# Altium schematic sheet output2.SchDoc
size A4
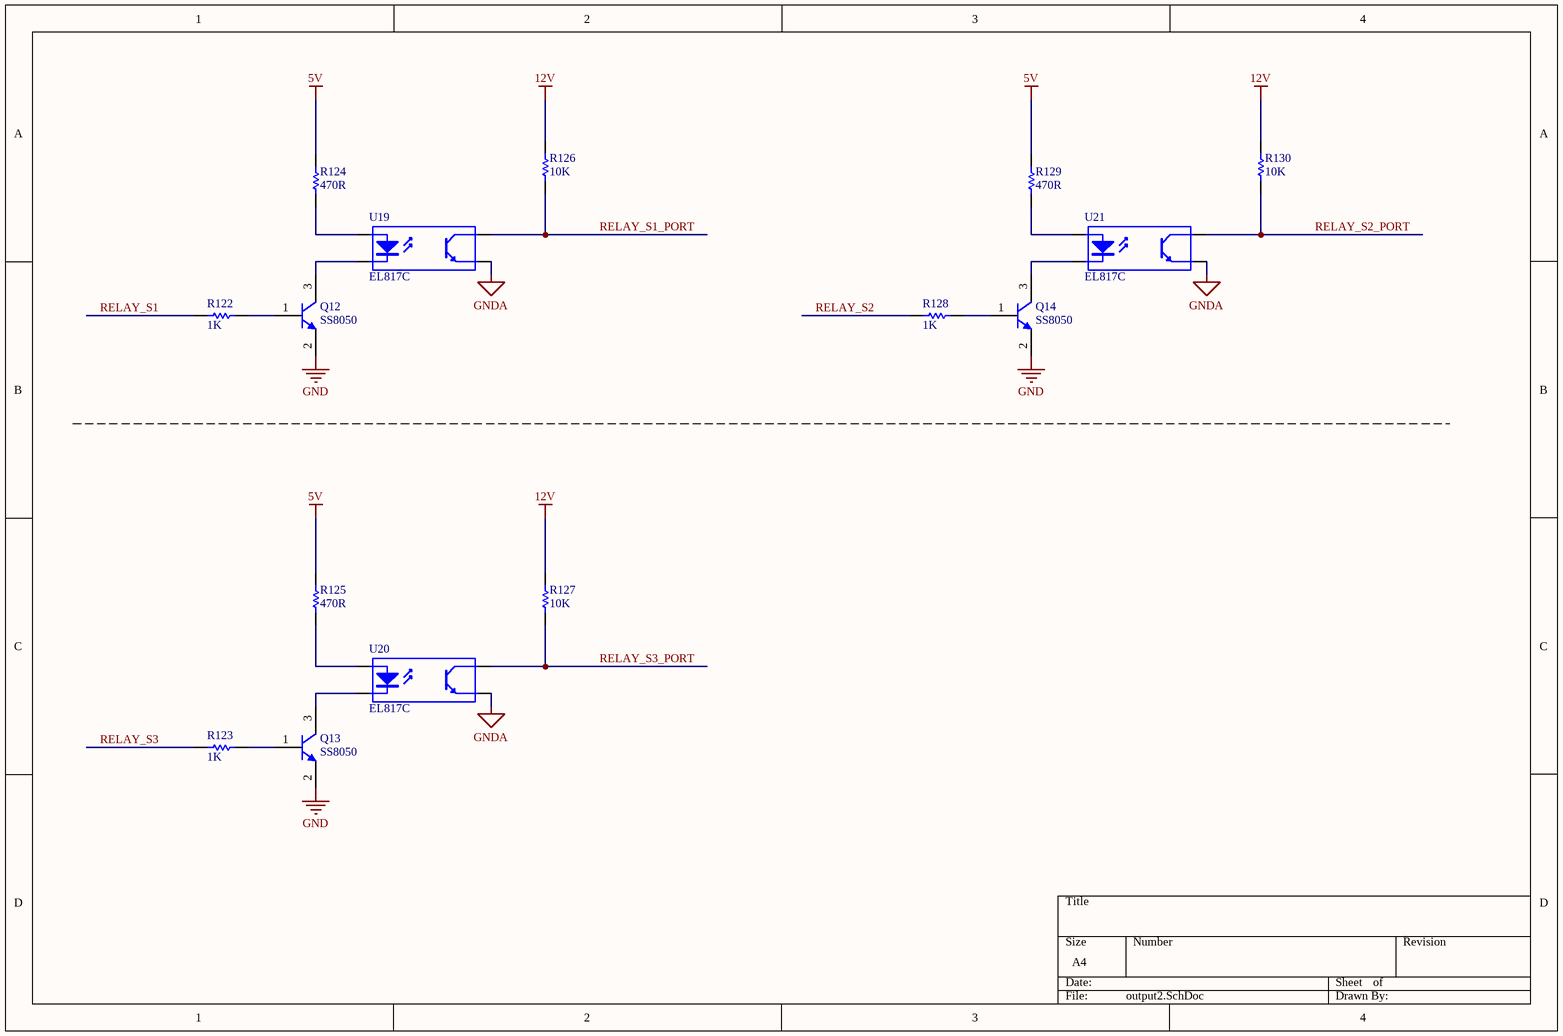
[diagram p0: output2.SchDoc]

## Parts
Q12  SS8050  [SOT-23_N]
Q13  SS8050  [SOT-23_N]
Q14  SS8050  [SOT-23_N]
R122  1K  [RESC2012M]
R123  1K  [RESC2012M]
R124  470R  [RESC2012M]
R125  470R  [RESC2012M]
R126  10K  [RESC2012M]
R127  10K  [RESC2012M]
R128  1K  [RESC2012M]
R129  470R  [RESC2012M]
R130  10K  [RESC2012M]
U19  EL817C  [SO-4LA]
U20  EL817C  [SO-4LA]
U21  EL817C  [SO-4LA]

## Nets
5V: R124.1 R125.1 R129.1
12V: R126.2 R127.2 R130.2
GND: Q12.2(E) Q13.2(E) Q14.2(E)
GNDA: U19.3(E) U20.3(E) U21.3(E)
RELAY_S1: R122.1
RELAY_S1_PORT: R126.1 U19.4(C)
RELAY_S2: R128.1
RELAY_S2_PORT: R130.1 U21.4(C)
RELAY_S3: R123.1
RELAY_S3_PORT: R127.1 U20.4(C)
NetQ12_1: Q12.1(B) R122.2
NetQ12_3: Q12.3(C) U19.2(K)
NetQ13_1: Q13.1(B) R123.2
NetQ13_3: Q13.3(C) U20.2(K)
NetQ14_1: Q14.1(B) R128.2
NetQ14_3: Q14.3(C) U21.2(K)
NetR124_2: R124.2 U19.1(A)
NetR125_2: R125.2 U20.1(A)
NetR129_2: R129.2 U21.1(A)

## Library data of the parts
Q12-Q14 = PMMT491A: NPN BISS Transistor; Published: 17-Sep-2003; LatestRevisionDate: 12-Dec-2006; LatestRevisionNote: IPC-7351 Footprint Added.; DatasheetVersion: 11-Jun-2001; PackageVersion: May-1999; PackageReference: SOT23; Publisher: Altium Limited; PackageDescription: 3-Pin SOT-23 Package 0.95 mm Pitch, 2.3 mm Lead Span; ComponentLink1Description: Manufacturer Link; ComponentLink1URL: http://www.semiconductors.philips.com/; ComponentLink2Description: Datasheet; ComponentLink2URL: http://www.semiconductors.philips.com/acrobat/datasheets/PMMT491A_5.pdf
R122-R125 R128 R129 = Res1: Resistor; Value: 10K; Published: 8-Jun-2000; LatestRevisionDate: 17-Jul-2002; LatestRevisionNote: Re-released for DXP Platform.; PackageReference: AXIAL-0.3; Publisher: Altium Limited
R126 R127 R130 = Res1: Resistor; Published: 8-Jun-2000; LatestRevisionDate: 17-Jul-2002; LatestRevisionNote: Re-released for DXP Platform.; PackageReference: AXIAL-0.3; Publisher: Altium Limited; Value: 10K
U19-U21 = Optoisolator1: 4-Pin Phototransistor Optocoupler; Published: 24-Mar-1999; LatestRevisionDate: 04-Mar-2005; LatestRevisionNote: Sch pins 3 & 4 Swapped.; DatasheetVersion: Nov-2003; PackageReference: DIP-4; Publisher: Altium Limited